# EAGLE schematic LM3S811 Module (EAGLE 6.3)
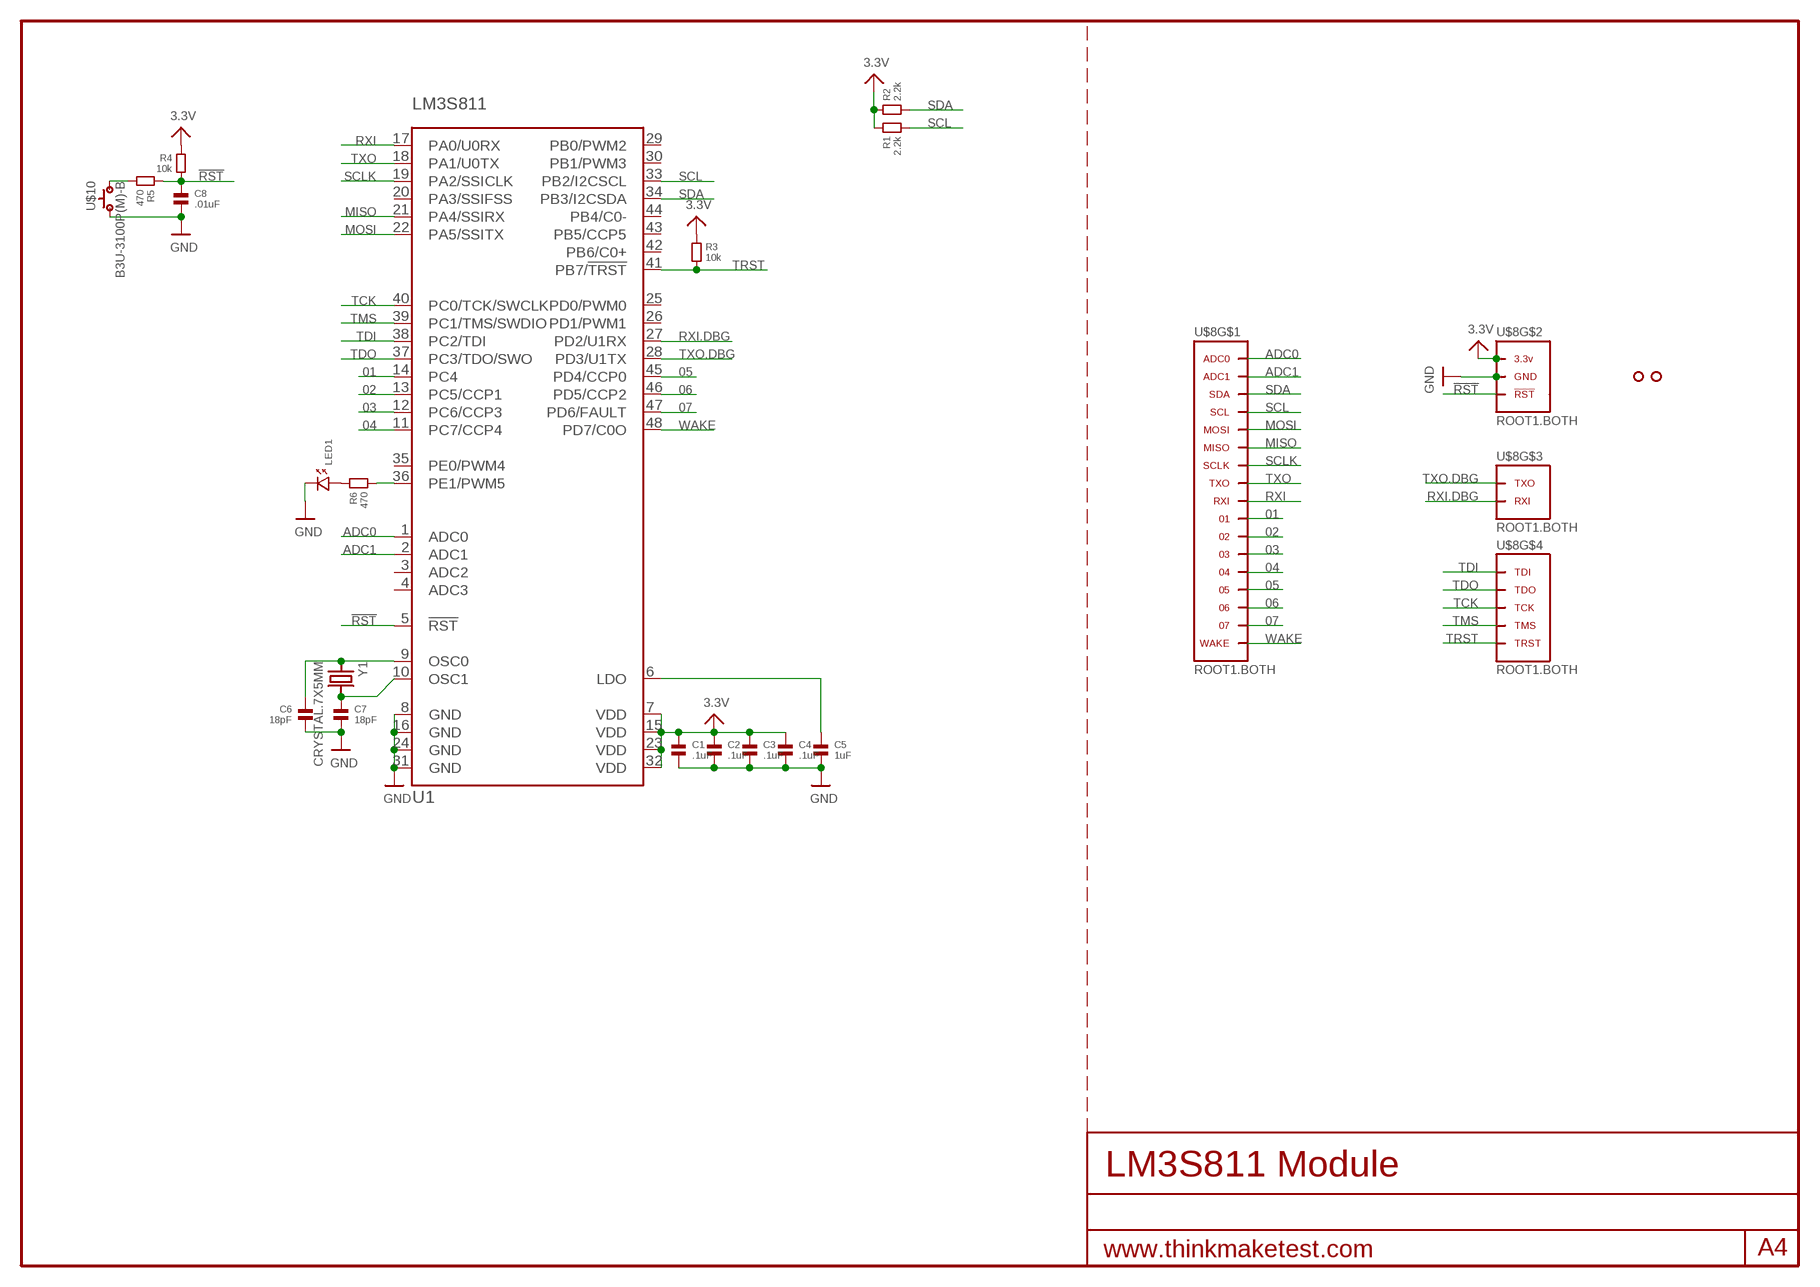
[diagram p0: schematic, sheet 1]

## Parts
C1  .1uF  CAPACITOR.0603  [0603]
C2  .1uF  CAPACITOR.0603  [0603]
C3  .1uF  CAPACITOR.0603  [0603]
C4  .1uF  CAPACITOR.0603  [0603]
C5  1uF  CAPACITOR.0603  [0603]
C6  18pF  CAPACITOR.0603  [0603]
C7  18pF  CAPACITOR.0603  [0603]
C8  .01uF  CAPACITOR.0603  [0603]
LED1  LED.0603  [0603.LED]
R1  2.2k  RESISTOR.0603  [0603]
R2  2.2k  RESISTOR.0603  [0603]
R3  10k  RESISTOR.0603  [0603]
R4  10k  RESISTOR.0603  [0603]
R5  470  RESISTOR.0603  [0603]
R6  470  RESISTOR.0603  [0603]
U1  LM3S811  [QFP50P900X900X160-48N]
U$3  HOLE.2MM  [2MM]
U$4  HOLE.2MM  [2MM]
U$8  ROOT1.BOTH  [ROOT1.BOTH]
U$10  B3U-3100P(M)-B  [B3U-3100P(M)-B]
Y1  CRYSTAL.7X5MM  [7X5MM]

## Nets
01: U1.14(PC4) U$8.01 U$8.01@1 U$8.01@VIA
02: U1.13(PC5/CCP1) U$8.02 U$8.02@1 U$8.02@VIA
03: U1.12(PC6/CCP3) U$8.03 U$8.03@1 U$8.03@VIA
3.3V: C1.1 C2.1 C3.1 C4.1 R1.1 R2.1 R3.1 R4.1 U1.7(VDD) U1.15(VDD) U1.23(VDD) U1.32(VDD) U$8.3.3V@1(3.3V) U$8.3.3V@2(3.3V) U$8.3.3V@3(3.3V) U$8.3.3V@4(3.3V) U$8.3.3V@5(3.3V) U$8.3.3V@6(3.3V) U$8.3.3V@7(3.3V) U$8.3.3V@8(3.3V) U$8.3.3V@9(3.3V) U$8.3.3V@10(3.3V) U$8.3.3V@11(3.3V) U$8.3.3V@12(3.3V) U$8.3.3V@13(3.3V) U$8.3.3V@14(3.3V) U$8.3.3V@15(3.3V) U$8.3.3V@16(3.3V) U$8.3.3V@17(3.3V) U$8.3.3V@18(3.3V) U$8.3.3V@19(3.3V) U$8.3.3V@20(3.3V) U$8.3.3V@21(3.3V) U$8.3.3V@22(3.3V) U$8.3.3V@23(3.3V) U$8.3.3V@24(3.3V) U$8.3.3V@VIA(3.3V)
04: U1.11(PC7/CCP4) U$8.04 U$8.04@1 U$8.04@VIA
05: U1.45(PD4/CCP0) U$8.05 U$8.05@1 U$8.05@VIA
06: U1.46(PD5/CCP2) U$8.06 U$8.06@1 U$8.06@VIA
07: U1.47(PD6/FAULT) U$8.07 U$8.07@1 U$8.07@VIA
!RST: C8.1 R4.2 R5.1 U1.5(!RST!) U$8.RST(!RST) U$8.RST@1(!RST) U$8.RST@VIA(!RST)
ADC0: U1.1(ADC0) U$8.ADC0 U$8.ADC0@1(ADC0) U$8.ADC0@VIA(ADC0)
ADC1: U1.2(ADC1) U$8.ADC1 U$8.ADC1@1(ADC1) U$8.ADC1@VIA(ADC1)
GND: C1.2 C2.2 C3.2 C4.2 C5.2 C6.2 C7.2 C8.2 LED1.P$2 U1.8(GND) U1.16(GND) U1.24(GND) U1.31(GND) U$8.GND@1(GND) U$8.GND@2(GND) U$8.GND@3(GND) U$8.GND@4(GND) U$8.GND@5(GND) U$8.GND@6(GND) U$8.GND@7(GND) U$8.GND@8(GND) U$8.GND@9(GND) U$8.GND@10(GND) U$8.GND@11(GND) U$8.GND@12(GND) U$8.GND@13(GND) U$8.GND@14(GND) U$8.GND@15(GND) U$8.GND@16(GND) U$8.GND@17(GND) U$8.GND@18(GND) U$8.GND@19(GND) U$8.GND@20(GND) U$8.GND@21(GND) U$8.GND@22(GND) U$8.GND@23(GND) U$8.GND@24(GND) U$8.GND@25(GND) U$8.GND@26(GND) U$8.GND@VIA(GND) U$10.2
MISO: U1.21(PA4/SSIRX) U$8.MISO U$8.MISO@1(MISO) U$8.MISO@VIA(MISO)
MOSI: U1.22(PA5/SSITX) U$8.MOSI U$8.MOSI@1(MOSI) U$8.MOSI@VIA(MOSI)
N$1: R5.2 U$10.1
N$2: LED1.P$1 R6.1
N$3: C5.1 U1.6(LDO)
N$4: R6.2 U1.36(PE1/PWM5)
N$7: C7.1 U1.10(OSC1) Y1.3
N$8: C6.1 U1.9(OSC0) Y1.1
RXI: U1.17(PA0/U0RX) U$8.RXI U$8.RXI@1(RXI) U$8.RXI@VIA(RXI)
RXI.DBG: U1.27(PD2/U1RX) U$8.RXI.DBG(RXI) U$8.RXI.DBG@1(RXI) U$8.RXI.DBG@VIA(RXI)
SCL: R1.2 U1.33(PB2/I2CSCL) U$8.SCL U$8.SCL@1(SCL) U$8.SCL@VIA(SCL)
SCLK: U1.19(PA2/SSICLK) U$8.SCLK U$8.SCLK@1(SCLK) U$8.SCLK@VIA(SCLK)
SDA: R2.2 U1.34(PB3/I2CSDA) U$8.SDA U$8.SDA@1(SDA) U$8.SDA@VIA(SDA)
TCK: U1.40(PC0/TCK/SWCLK) U$8.TCK U$8.TCK@1(TCK) U$8.TCK@VIA(TCK)
TDI: U1.38(PC2/TDI) U$8.TDI U$8.TDI@1(TDI) U$8.TDI@VIA(TDI)
TDO: U1.37(PC3/TDO/SWO) U$8.TDO U$8.TDO@1(TDO) U$8.TDO@VIA(TDO)
TMS: U1.39(PC1/TMS/SWDIO) U$8.TMS U$8.TMS@1(TMS) U$8.TMS@VIA(TMS)
TRST: R3.2 U1.41(PB7/!TRST!) U$8.TRST U$8.TRST@1(TRST) U$8.TRST@VIA(TRST)
TXO: U1.18(PA1/U0TX) U$8.TXO U$8.TXO@1(TXO) U$8.TXO@VIA(TXO)
TXO.DBG: U1.28(PD3/U1TX) U$8.TXO.DBG(TXO) U$8.TXO.DBG@1(TXO) U$8.TXO.DBG@VIA(TXO)
WAKE: U1.48(PD7/C0O) U$8.WAKE U$8.WAKE@1(WAKE) U$8.WAKE@VIA(WAKE)
Unconnected: U1.3(ADC2) U1.4(ADC3) U1.20(PA3/SSIFSS) U1.25(PD0/PWM0) U1.26(PD1/PWM1) U1.29(PB0/PWM2) U1.30(PB1/PWM3) U1.35(PE0/PWM4) U1.42(PB6/C0+) U1.43(PB5/CCP5) U1.44(PB4/C0-)

## Library data of the parts
C1-C8 = .standardparts:CAPACITOR
LED1 = .standardparts:LED
R1-R6 = .standardparts:RESISTOR
U1 = RASEagleLib:LM3S811: LM3S811 ARM Cortex M3 Microcontroller
U$3 U$4 = .screw_holes:HOLE
U$8 = thinkmaketest:ROOT1
U$10 = omron:B3U-3100P(M)
Y1 = abracon:CRYSTAL